# Altium schematic sheet RS485.SchDoc
size 420 x 297 mm; SheetNumber: 17; SheetTotal: 18
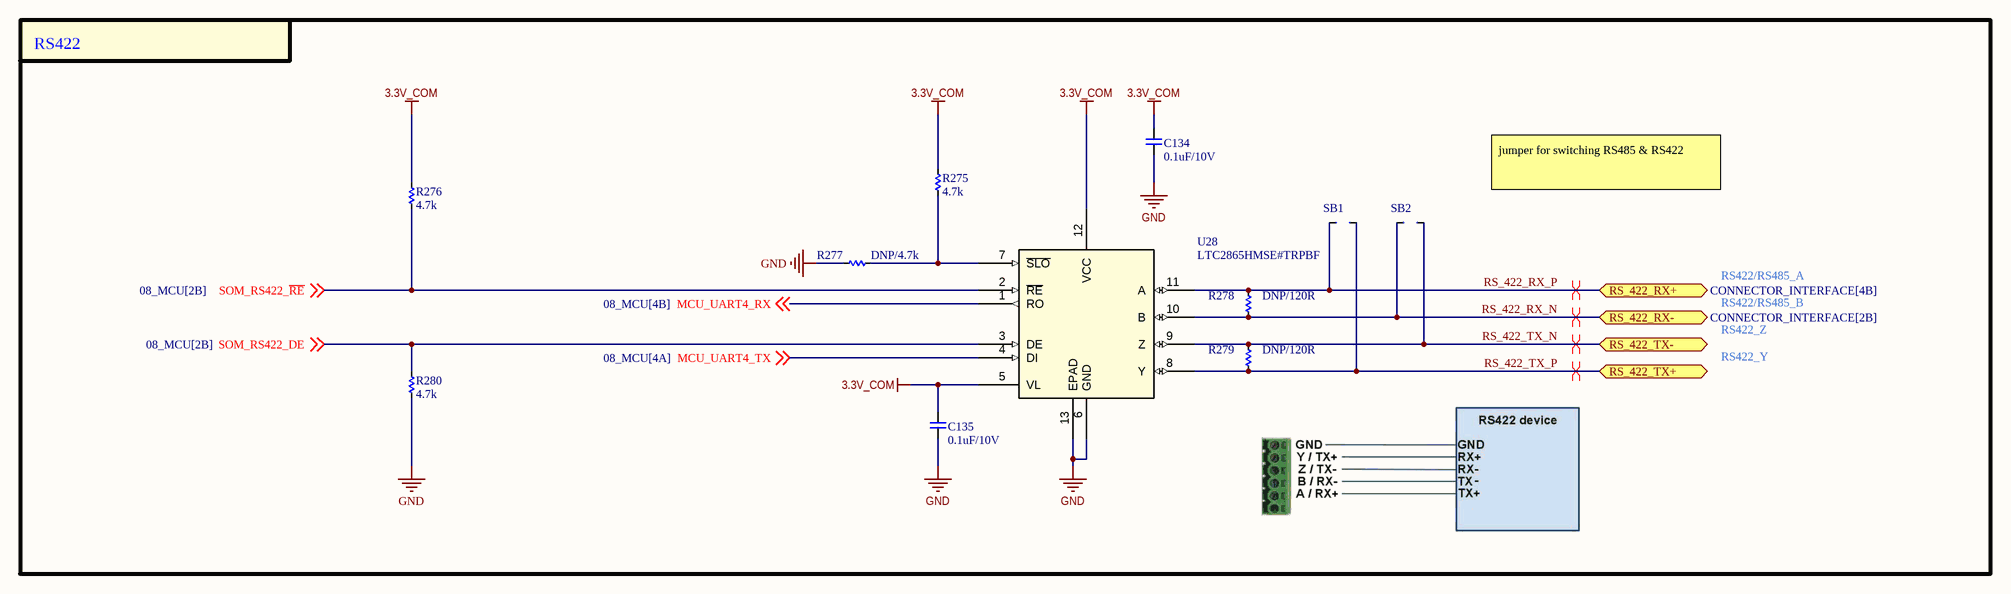
[diagram p0: RS485.SchDoc]

## Parts
C134  0.1uF/10V  [CAP_C_1005X50_L]
C135  0.1uF/10V  [CAP_C_1005X50_L]
R275  4.7k  [RES_C_1005x30_L]
R276  4.7k  [RES_C_1005x30_L]
R277  DNP/4.7k  [RES_C_1005x30_L]
R278  DNP/120R  [RES_C_1005x30_L]
R279  DNP/120R  [RES_C_1005x30_L]
R280  4.7k  [RES_C_1005x30_L]
SB1  JUMPER  [JUMPER_1608]  (value not drawn)
SB2  JUMPER  [JUMPER_1608]  (value not drawn)
U28  LTC2865HMSE#TRPBF  [MSOP-12_MSE_LIT]

## Ports
RS_422_RX+ (bidir, see CONNECTOR_INTERFACE[4B]), RS_422_RX- (bidir, see CONNECTOR_INTERFACE[2B]), RS_422_TX+ (bidir), RS_422_TX- (bidir)

## Nets
3.3V_COM: C134.2 C135.2 R275.2 R276.2 U28.5(VL) U28.12(VCC)
GND: C134.1 C135.1 R277.2 R280.1 U28.6(GND) U28.13(EPAD)
MCU_UART4_RX: U28.1(RO) ; off-sheet MCU_UART4_RX
MCU_UART4_TX: U28.4(DI) ; off-sheet MCU_UART4_TX
RS_422_RX_N: R278.2 SB2.1 U28.10(B) ; port RS_422_RX-
RS_422_RX_P: R278.1 SB1.1 U28.11(A) ; port RS_422_RX+
RS_422_TX_N: R279.1 SB2.2 U28.9(Z) ; port RS_422_TX-
RS_422_TX_P: R279.2 SB1.2 U28.8(Y) ; port RS_422_TX+
SOM_RS422_DE: R280.2 U28.3(DE) ; off-sheet SOM_RS422_DE
SOM_RS422_~{RE}: R276.1 U28.2(~{RE}) ; off-sheet SOM_RS422_~{RE}
NetR275_1: R275.1 R277.1 U28.7(~{SLO})

## Layout directives
differential pair: RS_422_RX_N, RS_422_RX_P, RS_422_TX_N, RS_422_TX_P

## Notes on the sheet
- RS422
- jumper for switching RS485 & RS422
- RS422/RS485_A
- RS422/RS485_B
- RS422_Z
- RS422_Y
- Project
- Sub-system:
- Design by:
- Sheet title:
- Sheet:
- of
- Checked by:
- Approved by:
- Doc no:
- Revision
- Size:
- Date:

## Library data of the parts
C134 C135 = _CAP_C_2: CAP
R275-R280 = _RES_B_2: RES
U28 = LTC2865HMSETRPBF: Â±60V Fault Protected 3V to 5.5V RS485/RS422 Transceivers; Manufacturer_Name: Analog Devices Inc; Copyright: Copyright (C) 2025 Ultra Librarian. All rights reserved.; Manufacturer_Part_Number: LTC2865HMSE#TRPBF; RefDes: RefDes; Type: Type